# Altium schematic sheet mcu-com-gpio-tim.SchDoc
size A3; DocumentNumber: 24; SheetNumber: 24; SheetTotal: 45; SheetDescription: MCU COM, GPIO and TIM
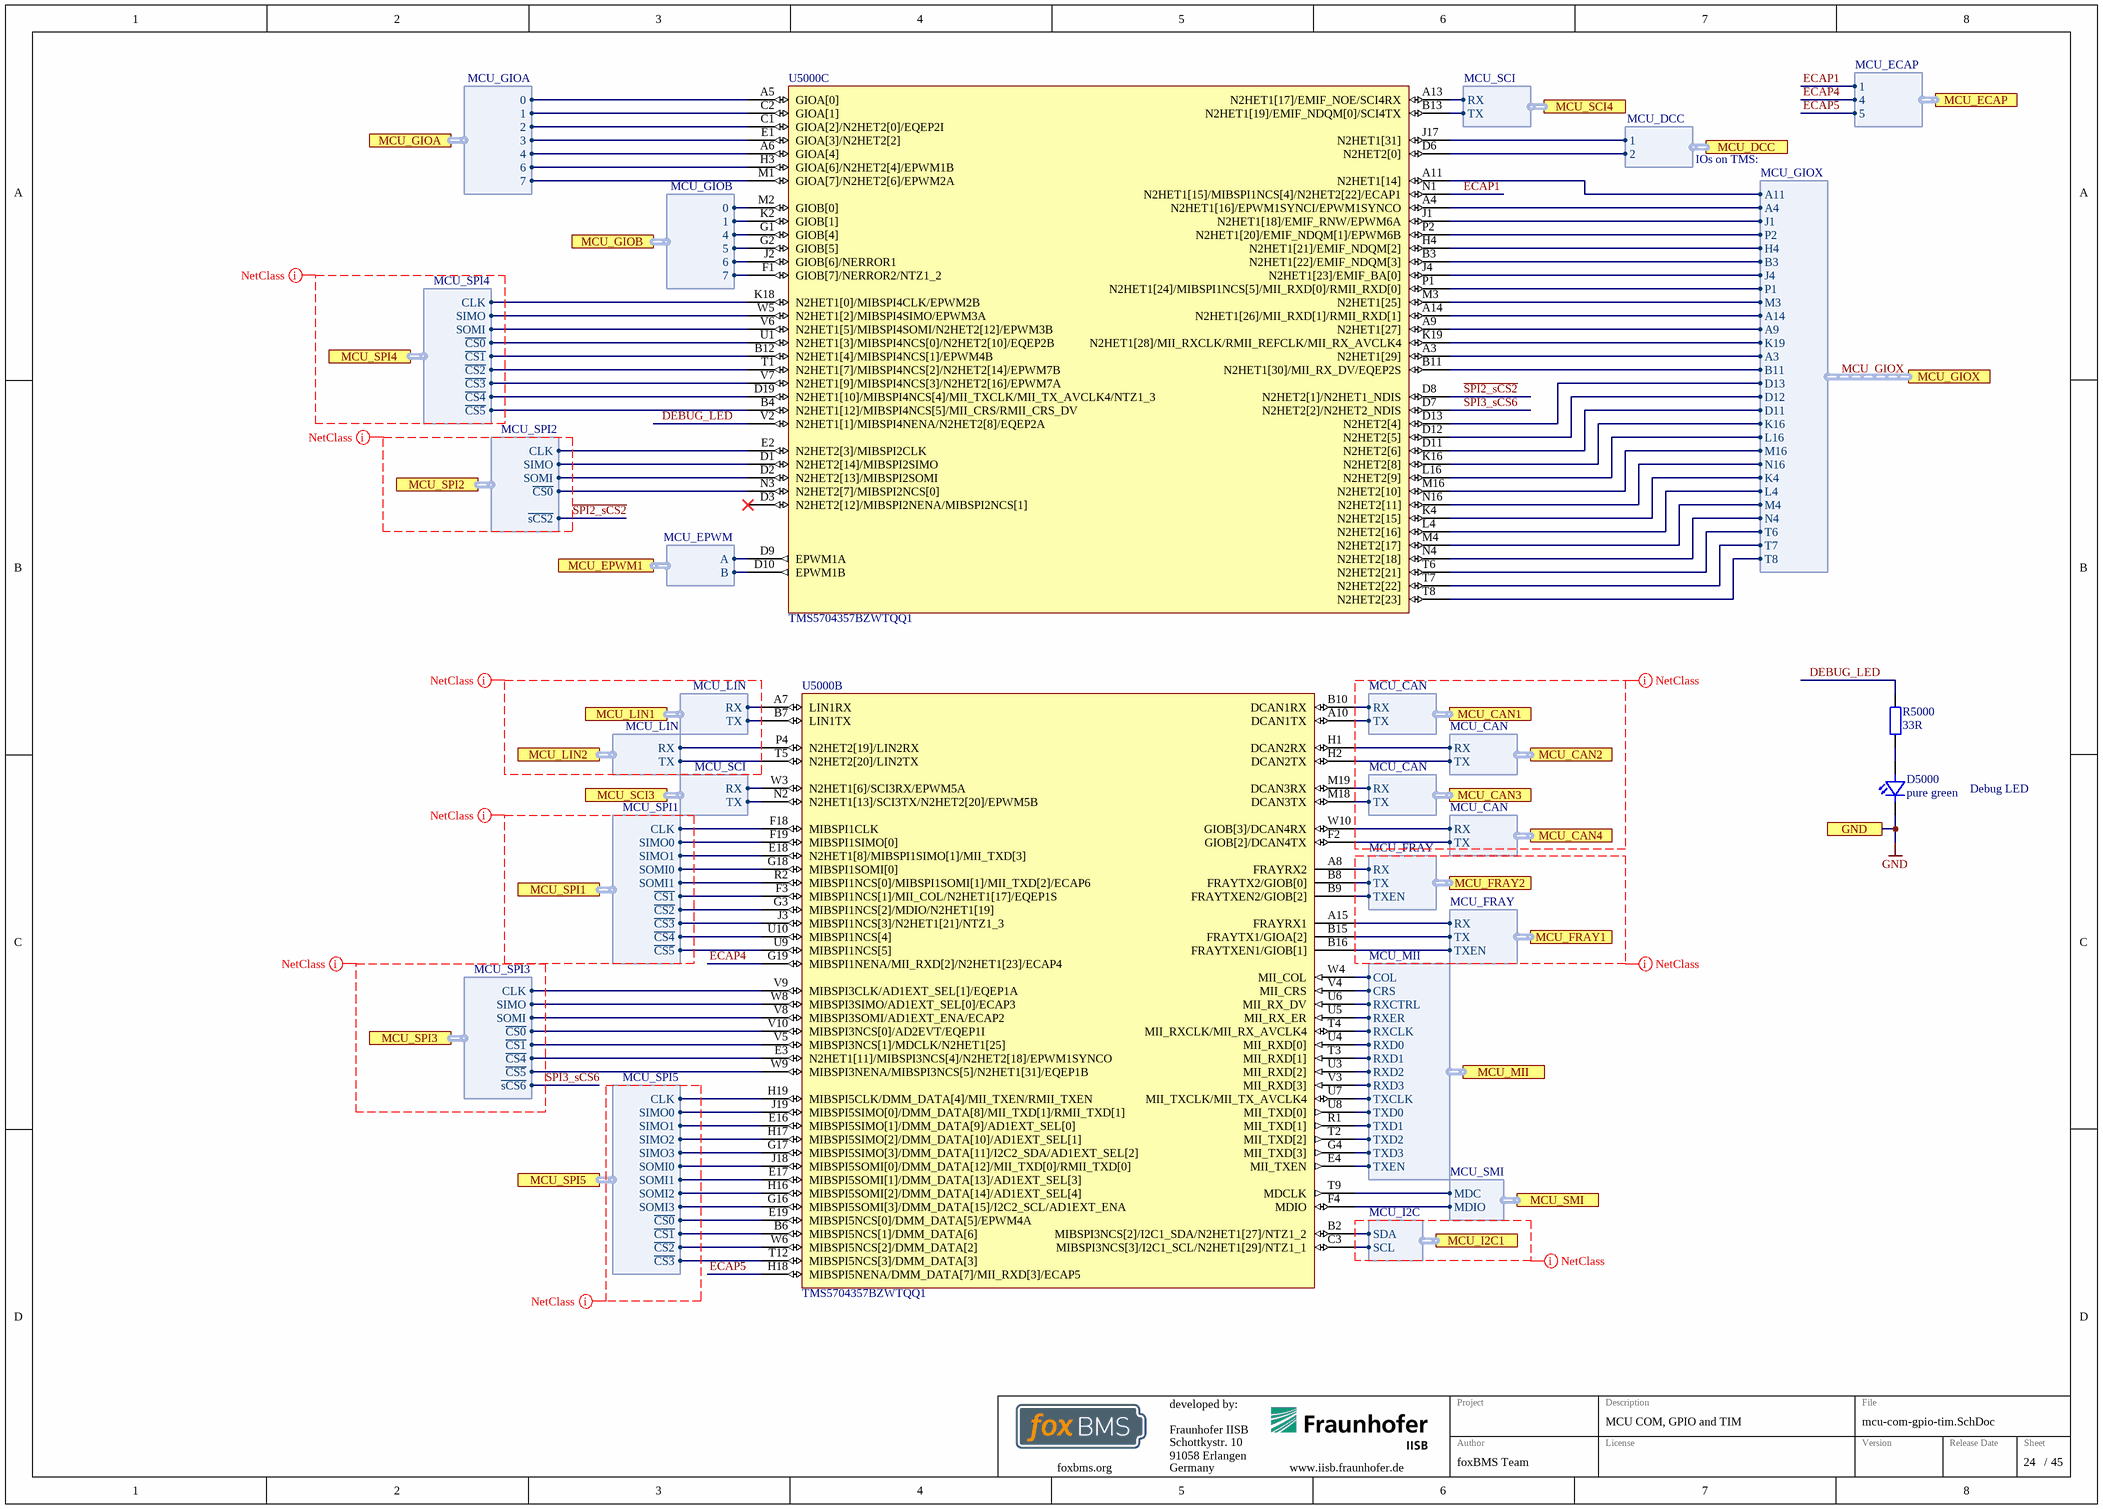
[diagram p0: mcu-com-gpio-tim.SchDoc]

## Parts
D5000  pure green  [LEDC1608X07N]
R5000  33R  [RESC1005X04N]
U5000  TMS5704357BZWTQQ1  [BGA337C80P19X19_1600X1600X140]  (parts B,C of 6)

## Ports
GND, MCU_CAN1 (harness MCU_CAN), MCU_CAN2 (harness MCU_CAN), MCU_CAN3 (harness MCU_CAN), MCU_CAN4 (harness MCU_CAN), MCU_DCC (harness MCU_DCC), MCU_ECAP (harness MCU_ECAP), MCU_EPWM1 (harness MCU_EPWM), MCU_FRAY1 (harness MCU_FRAY), MCU_FRAY2 (harness MCU_FRAY), MCU_GIOA (harness MCU_GIOA), MCU_GIOB (harness MCU_GIOB), MCU_GIOX (harness MCU_GIOX), MCU_I2C1 (harness MCU_I2C), MCU_LIN1 (harness MCU_LIN), MCU_LIN2 (harness MCU_LIN), MCU_MII (harness MCU_MII), MCU_SCI3 (harness MCU_SCI), MCU_SCI4 (harness MCU_SCI), MCU_SMI (harness MCU_SMI), MCU_SPI1 (harness MCU_SPI1), MCU_SPI2 (harness MCU_SPI2), MCU_SPI3 (harness MCU_SPI3), MCU_SPI4 (harness MCU_SPI4), MCU_SPI5 (harness MCU_SPI5)

## Harnesses
MCU_CAN: RX, TX
MCU_FRAY: RX, TX, TXEN
MCU_SMI: MDC, MDIO
MCU_MII: TXD0, TXD1, TXD2, TXD3, TXEN, TXCLK, RXCTRL, RXCLK, RXD3, RXD2, RXD0, RXD1, RXER, COL, CRS
MCU_LIN: RX, TX
MCU_SPI1: CLK, SIMO0, SOMI0, SOMI1, ~{CS1}, ~{CS2}, ~{CS3}, ~{CS4}, ~{CS5}, SIMO1
MCU_SPI3: CLK, SIMO, SOMI, ~{CS1}, ~{CS4}, ~{CS5}, ~{CS0}, ~{sCS6}
MCU_SPI5: CLK, SIMO0, SOMI0, SOMI1, ~{CS1}, ~{CS2}, ~{CS3}, ~{CS0}, SIMO1, SIMO2, SIMO3, SOMI2, SOMI3
MCU_SCI: RX, TX
MCU_I2C: SDA, SCL
MCU_SPI4: CLK, SIMO, SOMI, ~{CS1}, ~{CS2}, ~{CS3}, ~{CS0}, ~{CS4}, ~{CS5}
MCU_SPI2: CLK, SIMO, SOMI, ~{CS0}, ~{sCS2}
MCU_EPWM: A, B
MCU_GIOA: 0, 2, 3, 4, 6, 7, 1
MCU_GIOB: 0, 1, 4, 5, 6, 7
MCU_DCC: 1, 2
MCU_ECAP: 1, 4, 5
MCU_GIOX: A11, A4, J1, P2, H4, B3, J4, P1, M3, A14, A9, K19, A3, B11, D13, D12, D11, K16, L16, M16, N16, K4, L4, M4, T6, T7, N4, T8

## Nets
GND: D5000.1(C) ; port GND
~{SPI2_sCS2}: U5000.D8(N2HET2[1]/N2HET1_NDIS) ; port MCU_SPI2.~{sCS2}
~{SPI3_sCS6}: U5000.D7(N2HET2[2]/N2HET2_NDIS) ; port MCU_SPI3.~{sCS6}
DEBUG_LED: R5000.2 U5000.V2(N2HET1[1]/MIBSPI4NENA/N2HET2[8]/EQEP2A)
ECAP1: U5000.N1(N2HET1[15]/MIBSPI1NCS[4]/N2HET2[22]/ECAP1) ; port MCU_ECAP.1
ECAP4: U5000.G19(MIBSPI1NENA/MII_RXD[2]/N2HET1[23]/ECAP4) ; port MCU_ECAP.4
ECAP5: U5000.H18(MIBSPI5NENA/DMM_DATA[7]/MII_RXD[3]/ECAP5) ; port MCU_ECAP.5
MCU_GIOX.A3: U5000.A3(N2HET1[29]) ; port MCU_GIOX.A3
MCU_GIOX.A4: U5000.A4(N2HET1[16]/EPWM1SYNCI/EPWM1SYNCO) ; port MCU_GIOX.A4
MCU_GIOX.A9: U5000.A9(N2HET1[27]) ; port MCU_GIOX.A9
MCU_GIOX.A11: U5000.A11(N2HET1[14]) ; port MCU_GIOX.A11
MCU_GIOX.A14: U5000.A14(N2HET1[26]/MII_RXD[1]/RMII_RXD[1]) ; port MCU_GIOX.A14
MCU_GIOX.B3: U5000.B3(N2HET1[22]/EMIF_NDQM[3]) ; port MCU_GIOX.B3
MCU_GIOX.B11: U5000.B11(N2HET1[30]/MII_RX_DV/EQEP2S) ; port MCU_GIOX.B11
MCU_GIOX.D11: U5000.D11(N2HET2[6]) ; port MCU_GIOX.D11
MCU_GIOX.D12: U5000.D12(N2HET2[5]) ; port MCU_GIOX.D12
MCU_GIOX.D13: U5000.D13(N2HET2[4]) ; port MCU_GIOX.D13
MCU_GIOX.H4: U5000.H4(N2HET1[21]/EMIF_NDQM[2]) ; port MCU_GIOX.H4
MCU_GIOX.J1: U5000.J1(N2HET1[18]/EMIF_RNW/EPWM6A) ; port MCU_GIOX.J1
MCU_GIOX.J4: U5000.J4(N2HET1[23]/EMIF_BA[0]) ; port MCU_GIOX.J4
MCU_GIOX.K4: U5000.K4(N2HET2[15]) ; port MCU_GIOX.K4
MCU_GIOX.K16: U5000.K16(N2HET2[8]) ; port MCU_GIOX.K16
MCU_GIOX.K19: U5000.K19(N2HET1[28]/MII_RXCLK/RMII_REFCLK/MII_RX_AVCLK4) ; port MCU_GIOX.K19
MCU_GIOX.L4: U5000.L4(N2HET2[16]) ; port MCU_GIOX.L4
MCU_GIOX.L16: U5000.L16(N2HET2[9]) ; port MCU_GIOX.L16
MCU_GIOX.M3: U5000.M3(N2HET1[25]) ; port MCU_GIOX.M3
MCU_GIOX.M4: U5000.M4(N2HET2[17]) ; port MCU_GIOX.M4
MCU_GIOX.M16: U5000.M16(N2HET2[10]) ; port MCU_GIOX.M16
MCU_GIOX.N4: U5000.N4(N2HET2[18]) ; port MCU_GIOX.N4
MCU_GIOX.N16: U5000.N16(N2HET2[11]) ; port MCU_GIOX.N16
MCU_GIOX.P1: U5000.P1(N2HET1[24]/MIBSPI1NCS[5]/MII_RXD[0]/RMII_RXD[0]) ; port MCU_GIOX.P1
MCU_GIOX.P2: U5000.P2(N2HET1[20]/EMIF_NDQM[1]/EPWM6B) ; port MCU_GIOX.P2
MCU_GIOX.T6: U5000.T6(N2HET2[21]) ; port MCU_GIOX.T6
MCU_GIOX.T7: U5000.T7(N2HET2[22]) ; port MCU_GIOX.T7
MCU_GIOX.T8: U5000.T8(N2HET2[23]) ; port MCU_GIOX.T8
NetD5000_2: D5000.2(A) R5000.1
NetU5000_A5: U5000.A5(GIOA[0]) ; port MCU_GIOA.0
NetU5000_A6: U5000.A6(GIOA[4]) ; port MCU_GIOA.4
NetU5000_A7: U5000.A7(LIN1RX) ; port MCU_LIN1.RX
NetU5000_A8: U5000.A8(FRAYRX2) ; port MCU_FRAY2.RX
NetU5000_A10: U5000.A10(DCAN1TX) ; port MCU_CAN1.TX
NetU5000_A13: U5000.A13(N2HET1[17]/EMIF_NOE/SCI4RX) ; port MCU_SCI4.RX
NetU5000_A15: U5000.A15(FRAYRX1) ; port MCU_FRAY1.RX
NetU5000_B2: U5000.B2(MIBSPI3NCS[2]/I2C1_SDA/N2HET1[27]/NTZ1_2) ; port MCU_I2C1.SDA
NetU5000_B4: U5000.B4(N2HET1[12]/MIBSPI4NCS[5]/MII_CRS/RMII_CRS_DV) ; port MCU_SPI4.~{CS5}
NetU5000_B6: U5000.B6(MIBSPI5NCS[1]/DMM_DATA[6]) ; port MCU_SPI5.~{CS1}
NetU5000_B7: U5000.B7(LIN1TX) ; port MCU_LIN1.TX
NetU5000_B8: U5000.B8(FRAYTX2/GIOB[0]) ; port MCU_FRAY2.TX
NetU5000_B9: U5000.B9(FRAYTXEN2/GIOB[2]) ; port MCU_FRAY2.TXEN
NetU5000_B10: U5000.B10(DCAN1RX) ; port MCU_CAN1.RX
NetU5000_B12: U5000.B12(N2HET1[4]/MIBSPI4NCS[1]/EPWM4B) ; port MCU_SPI4.~{CS1}
NetU5000_B13: U5000.B13(N2HET1[19]/EMIF_NDQM[0]/SCI4TX) ; port MCU_SCI4.TX
NetU5000_B15: U5000.B15(FRAYTX1/GIOA[2]) ; port MCU_FRAY1.TX
NetU5000_B16: U5000.B16(FRAYTXEN1/GIOB[1]) ; port MCU_FRAY1.TXEN
NetU5000_C1: U5000.C1(GIOA[2]/N2HET2[0]/EQEP2I) ; port MCU_GIOA.2
NetU5000_C2: U5000.C2(GIOA[1]) ; port MCU_GIOA.1
NetU5000_C3: U5000.C3(MIBSPI3NCS[3]/I2C1_SCL/N2HET1[29]/NTZ1_1) ; port MCU_I2C1.SCL
NetU5000_D1: U5000.D1(N2HET2[14]/MIBSPI2SIMO) ; port MCU_SPI2.SIMO
NetU5000_D2: U5000.D2(N2HET2[13]/MIBSPI2SOMI) ; port MCU_SPI2.SOMI
NetU5000_D6: U5000.D6(N2HET2[0]) ; port MCU_DCC.2
NetU5000_D9: U5000.D9(EPWM1A) ; port MCU_EPWM1.A
NetU5000_D10: U5000.D10(EPWM1B) ; port MCU_EPWM1.B
NetU5000_D19: U5000.D19(N2HET1[10]/MIBSPI4NCS[4]/MII_TXCLK/MII_TX_AVCLK4/NTZ1_3) ; port MCU_SPI4.~{CS4}
NetU5000_E1: U5000.E1(GIOA[3]/N2HET2[2]) ; port MCU_GIOA.3
NetU5000_E2: U5000.E2(N2HET2[3]/MIBSPI2CLK) ; port MCU_SPI2.CLK
NetU5000_E3: U5000.E3(N2HET1[11]/MIBSPI3NCS[4]/N2HET2[18]/EPWM1SYNCO) ; port MCU_SPI3.~{CS4}
NetU5000_E4: U5000.E4(MII_TXEN) ; port MCU_MII.TXEN
NetU5000_E16: U5000.E16(MIBSPI5SIMO[1]/DMM_DATA[9]/AD1EXT_SEL[0]) ; port MCU_SPI5.SIMO1
NetU5000_E17: U5000.E17(MIBSPI5SOMI[1]/DMM_DATA[13]/AD1EXT_SEL[3]) ; port MCU_SPI5.SOMI1
NetU5000_E18: U5000.E18(N2HET1[8]/MIBSPI1SIMO[1]/MII_TXD[3]) ; port MCU_SPI1.SIMO1
NetU5000_E19: U5000.E19(MIBSPI5NCS[0]/DMM_DATA[5]/EPWM4A) ; port MCU_SPI5.~{CS0}
NetU5000_F1: U5000.F1(GIOB[7]/NERROR2/NTZ1_2) ; port MCU_GIOB.7
NetU5000_F2: U5000.F2(GIOB[2]/DCAN4TX) ; port MCU_CAN4.TX
NetU5000_F3: U5000.F3(MIBSPI1NCS[1]/MII_COL/N2HET1[17]/EQEP1S) ; port MCU_SPI1.~{CS1}
NetU5000_F4: U5000.F4(MDIO) ; port MCU_SMI.MDIO
NetU5000_F18: U5000.F18(MIBSPI1CLK) ; port MCU_SPI1.CLK
NetU5000_F19: U5000.F19(MIBSPI1SIMO[0]) ; port MCU_SPI1.SIMO0
NetU5000_G1: U5000.G1(GIOB[4]) ; port MCU_GIOB.4
NetU5000_G2: U5000.G2(GIOB[5]) ; port MCU_GIOB.5
NetU5000_G3: U5000.G3(MIBSPI1NCS[2]/MDIO/N2HET1[19]) ; port MCU_SPI1.~{CS2}
NetU5000_G4: U5000.G4(MII_TXD[3]) ; port MCU_MII.TXD3
NetU5000_G16: U5000.G16(MIBSPI5SOMI[3]/DMM_DATA[15]/I2C2_SCL/AD1EXT_ENA) ; port MCU_SPI5.SOMI3
NetU5000_G17: U5000.G17(MIBSPI5SIMO[3]/DMM_DATA[11]/I2C2_SDA/AD1EXT_SEL[2]) ; port MCU_SPI5.SIMO3
NetU5000_G18: U5000.G18(MIBSPI1SOMI[0]) ; port MCU_SPI1.SOMI0
NetU5000_H1: U5000.H1(DCAN2RX) ; port MCU_CAN2.RX
NetU5000_H2: U5000.H2(DCAN2TX) ; port MCU_CAN2.TX
NetU5000_H3: U5000.H3(GIOA[6]/N2HET2[4]/EPWM1B) ; port MCU_GIOA.6
NetU5000_H16: U5000.H16(MIBSPI5SOMI[2]/DMM_DATA[14]/AD1EXT_SEL[4]) ; port MCU_SPI5.SOMI2
NetU5000_H17: U5000.H17(MIBSPI5SIMO[2]/DMM_DATA[10]/AD1EXT_SEL[1]) ; port MCU_SPI5.SIMO2
NetU5000_H19: U5000.H19(MIBSPI5CLK/DMM_DATA[4]/MII_TXEN/RMII_TXEN) ; port MCU_SPI5.CLK
NetU5000_J2: U5000.J2(GIOB[6]/NERROR1) ; port MCU_GIOB.6
NetU5000_J3: U5000.J3(MIBSPI1NCS[3]/N2HET1[21]/NTZ1_3) ; port MCU_SPI1.~{CS3}
NetU5000_J17: U5000.J17(N2HET1[31]) ; port MCU_DCC.1
NetU5000_J18: U5000.J18(MIBSPI5SOMI[0]/DMM_DATA[12]/MII_TXD[0]/RMII_TXD[0]) ; port MCU_SPI5.SOMI0
NetU5000_J19: U5000.J19(MIBSPI5SIMO[0]/DMM_DATA[8]/MII_TXD[1]/RMII_TXD[1]) ; port MCU_SPI5.SIMO0
NetU5000_K2: U5000.K2(GIOB[1]) ; port MCU_GIOB.1
NetU5000_K18: U5000.K18(N2HET1[0]/MIBSPI4CLK/EPWM2B) ; port MCU_SPI4.CLK
NetU5000_M1: U5000.M1(GIOA[7]/N2HET2[6]/EPWM2A) ; port MCU_GIOA.7
NetU5000_M2: U5000.M2(GIOB[0]) ; port MCU_GIOB.0
NetU5000_M18: U5000.M18(DCAN3TX) ; port MCU_CAN3.TX
NetU5000_M19: U5000.M19(DCAN3RX) ; port MCU_CAN3.RX
NetU5000_N2: U5000.N2(N2HET1[13]/SCI3TX/N2HET2[20]/EPWM5B) ; port MCU_SCI3.TX
NetU5000_N3: U5000.N3(N2HET2[7]/MIBSPI2NCS[0]) ; port MCU_SPI2.~{CS0}
NetU5000_P4: U5000.P4(N2HET2[19]/LIN2RX) ; port MCU_LIN2.RX
NetU5000_R1: U5000.R1(MII_TXD[1]) ; port MCU_MII.TXD1
NetU5000_R2: U5000.R2(MIBSPI1NCS[0]/MIBSPI1SOMI[1]/MII_TXD[2]/ECAP6) ; port MCU_SPI1.SOMI1
NetU5000_T1: U5000.T1(N2HET1[7]/MIBSPI4NCS[2]/N2HET2[14]/EPWM7B) ; port MCU_SPI4.~{CS2}
NetU5000_T2: U5000.T2(MII_TXD[2]) ; port MCU_MII.TXD2
NetU5000_T3: U5000.T3(MII_RXD[1]) ; port MCU_MII.RXD1
NetU5000_T4: U5000.T4(MII_RXCLK/MII_RX_AVCLK4) ; port MCU_MII.RXCLK
NetU5000_T5: U5000.T5(N2HET2[20]/LIN2TX) ; port MCU_LIN2.TX
NetU5000_T9: U5000.T9(MDCLK) ; port MCU_SMI.MDC
NetU5000_T12: U5000.T12(MIBSPI5NCS[3]/DMM_DATA[3]) ; port MCU_SPI5.~{CS3}
NetU5000_U1: U5000.U1(N2HET1[3]/MIBSPI4NCS[0]/N2HET2[10]/EQEP2B) ; port MCU_SPI4.~{CS0}
NetU5000_U3: U5000.U3(MII_RXD[2]) ; port MCU_MII.RXD2
NetU5000_U4: U5000.U4(MII_RXD[0]) ; port MCU_MII.RXD0
NetU5000_U5: U5000.U5(MII_RX_ER) ; port MCU_MII.RXER
NetU5000_U6: U5000.U6(MII_RX_DV) ; port MCU_MII.RXCTRL
NetU5000_U7: U5000.U7(MII_TXCLK/MII_TX_AVCLK4) ; port MCU_MII.TXCLK
NetU5000_U8: U5000.U8(MII_TXD[0]) ; port MCU_MII.TXD0
NetU5000_U9: U5000.U9(MIBSPI1NCS[5]) ; port MCU_SPI1.~{CS5}
NetU5000_U10: U5000.U10(MIBSPI1NCS[4]) ; port MCU_SPI1.~{CS4}
NetU5000_V3: U5000.V3(MII_RXD[3]) ; port MCU_MII.RXD3
NetU5000_V4: U5000.V4(MII_CRS) ; port MCU_MII.CRS
NetU5000_V5: U5000.V5(MIBSPI3NCS[1]/MDCLK/N2HET1[25]) ; port MCU_SPI3.~{CS1}
NetU5000_V6: U5000.V6(N2HET1[5]/MIBSPI4SOMI/N2HET2[12]/EPWM3B) ; port MCU_SPI4.SOMI
NetU5000_V7: U5000.V7(N2HET1[9]/MIBSPI4NCS[3]/N2HET2[16]/EPWM7A) ; port MCU_SPI4.~{CS3}
NetU5000_V8: U5000.V8(MIBSPI3SOMI/AD1EXT_ENA/ECAP2) ; port MCU_SPI3.SOMI
NetU5000_V9: U5000.V9(MIBSPI3CLK/AD1EXT_SEL[1]/EQEP1A) ; port MCU_SPI3.CLK
NetU5000_V10: U5000.V10(MIBSPI3NCS[0]/AD2EVT/EQEP1I) ; port MCU_SPI3.~{CS0}
NetU5000_W3: U5000.W3(N2HET1[6]/SCI3RX/EPWM5A) ; port MCU_SCI3.RX
NetU5000_W4: U5000.W4(MII_COL) ; port MCU_MII.COL
NetU5000_W5: U5000.W5(N2HET1[2]/MIBSPI4SIMO/EPWM3A) ; port MCU_SPI4.SIMO
NetU5000_W6: U5000.W6(MIBSPI5NCS[2]/DMM_DATA[2]) ; port MCU_SPI5.~{CS2}
NetU5000_W8: U5000.W8(MIBSPI3SIMO/AD1EXT_SEL[0]/ECAP3) ; port MCU_SPI3.SIMO
NetU5000_W9: U5000.W9(MIBSPI3NENA/MIBSPI3NCS[5]/N2HET1[31]/EQEP1B) ; port MCU_SPI3.~{CS5}
NetU5000_W10: U5000.W10(GIOB[3]/DCAN4RX) ; port MCU_CAN4.RX

Not connected (* = marked no-connect by the designer): U5000 D3(N2HET2[12]/MIBSPI2NENA/MIBSPI2NCS[1])*

## Buses and harness runs
harness MCU_GIOX = port MCU_GIOX

## Layout directives
net class MCU_CAN: (no net found under the mark)
net class MCU_FRAY: (no net found under the mark)
net class MCU_SPI1: (no net found under the mark)
net class MCU_SPI3: ~{SPI3_sCS6}
net class MCU_SPI5: (no net found under the mark)
net class MCU_SPI2: ~{SPI2_sCS2}
net class MCU_SPI4: (no net found under the mark)
net class MCU_LIN: (no net found under the mark)
net class MCU_I2C: (no net found under the mark)

## Notes on the sheet
- standard IOs on TMS:
- Debug LED
- Fraunhofer IISB
- Schottkystr. 10
- developed by:
- 91058 Erlangen
- Germany
- Author
- Project
- License
- Description
- File
- Version
- Release Date
- Sheet
- foxbms.org <https://foxbms.org>
- www.iisb.fraunhofer.de <https://www.iisb.fraunhofer.de/>
- foxBMS Team
- /

## Library data of the parts
D5000 = LED_0603_pure_green_AECQ: TLMP1100-GS08; Manufacturer: Vishay; Breakdown Voltage: 5V; Continuous Forward Current: 20mA; Forward Voltage @ 20mA: 2.1V; Automotive Qualified: True; Part Number: LED_0603_pure_green_AECQ; Color: pure green; Operating Temperature: -40°C - 100°C; ComponentLink1Description: Datasheet; ComponentLink1URL: http://www.farnell.com/datasheets/2049164.pdf; Supplier 1: Farnell; Supplier Part Number 1: 1328306; Supplier 2: Digikey; Supplier Part Number 2: 751-1176-1-ND; PnP Package: LED_0603
R5000 = gen_R_33R_0402: SMD Resistor 33R 0402; Tolerance: 1%; Power: 0.063W; Case EIA: 0402; Case Metric: 1005; Maximum Working Voltage: 50V; PnP Package: 0402R; Automotive Qualified: True; AEC-Q Grade: Grade 0; AEC-Q Norm: AEC-Q200; Part Number: gen_R_33R_0402; Operating Temperature: -55°C - +155°C; Resistance: 33R; Series: E24; PnP Value: 33R; ECCN: EAR99; Supplier 1: Digikey; Supplier Part Number 1: A129609CT-ND